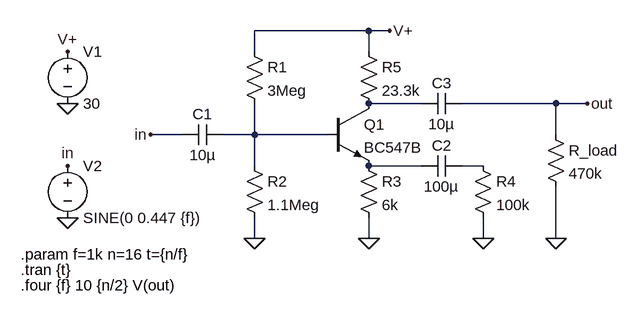
[diagram p0: schematic ClassAPreAmp.asc]
ClassAPreAmp.asc, the LTspice schematic file:
Version 4
SHEET 1 1060 680
WIRE 640 -96 464 -96
WIRE 672 -96 640 -96
WIRE 464 -64 464 -96
WIRE 640 -64 640 -96
WIRE 720 16 640 16
WIRE 928 16 784 16
WIRE 976 16 928 16
WIRE 352 64 304 64
WIRE 464 64 464 16
WIRE 464 64 416 64
WIRE 576 64 464 64
WIRE 928 64 928 16
WIRE 464 112 464 64
WIRE 720 112 640 112
WIRE 816 112 784 112
WIRE 464 224 464 192
WIRE 640 224 640 192
WIRE 816 224 816 192
WIRE 928 224 928 144
FLAG 176 -64 V+
FLAG 176 16 0
FLAG 176 112 in
FLAG 176 192 0
FLAG 304 64 in
FLAG 464 224 0
FLAG 640 224 0
FLAG 816 224 0
FLAG 672 -96 V+
FLAG 976 16 out
FLAG 928 224 0
SYMBOL voltage 176 -80 R0
WINDOW 123 0 0 Left 0
WINDOW 39 0 0 Left 0
SYMATTR InstName V1
SYMATTR Value 30
SYMBOL voltage 176 96 R0
WINDOW 123 0 0 Left 0
WINDOW 39 0 0 Left 0
SYMATTR InstName V2
SYMATTR Value SINE(0 0.447 {f})
SYMBOL cap 416 48 R90
WINDOW 0 0 32 VBottom 2
WINDOW 3 32 32 VTop 2
SYMATTR InstName C1
SYMATTR Value 10µ
SYMBOL res 448 -80 R0
SYMATTR InstName R1
SYMATTR Value 3Meg
SYMBOL res 448 96 R0
SYMATTR InstName R2
SYMATTR Value 1.1Meg
SYMBOL npn 576 16 R0
SYMATTR InstName Q1
SYMATTR Value BC547B
SYMBOL res 624 96 R0
SYMATTR InstName R3
SYMATTR Value 6k
SYMBOL cap 784 96 R90
WINDOW 0 0 32 VBottom 2
WINDOW 3 32 32 VTop 2
SYMATTR InstName C2
SYMATTR Value 100µ
SYMBOL res 800 96 R0
SYMATTR InstName R4
SYMATTR Value 100k
SYMBOL res 624 -80 R0
SYMATTR InstName R5
SYMATTR Value 23.3k
SYMBOL cap 784 0 R90
WINDOW 0 0 32 VBottom 2
WINDOW 3 32 32 VTop 2
SYMATTR InstName C3
SYMATTR Value 10µ
SYMBOL res 912 48 R0
SYMATTR InstName R_load
SYMATTR Value 470k
TEXT 104 272 Left 2 !.tran {t}
TEXT 104 248 Left 2 !.param f=1k n=16 t={n/f}
TEXT 104 296 Left 2 !.four {f} 10 {n/2} V(out)

The netlist it stands for:
* ClassAPreAmp.asc
V1 V+ 0 30
V2 in 0 SINE(0 0.447 {f})
C1 N002 in 10µ
R1 V+ N002 3Meg
R2 N002 0 1.1Meg
Q1 N001 N002 N003 0 BC547B
R3 N003 0 6k
C2 N004 N003 100µ
R4 N004 0 100k
R5 V+ N001 23.3k
C3 out N001 10µ
R_load out 0 470k
.model NPN NPN
.model PNP PNP
.lib standard.bjt
.tran {t}
.param f=1k n=16 t={n/f}
.four {f} 10 {n/2} V(out)
.backanno
.end